# EAGLE design cp2104 (EAGLE 9.3.0)
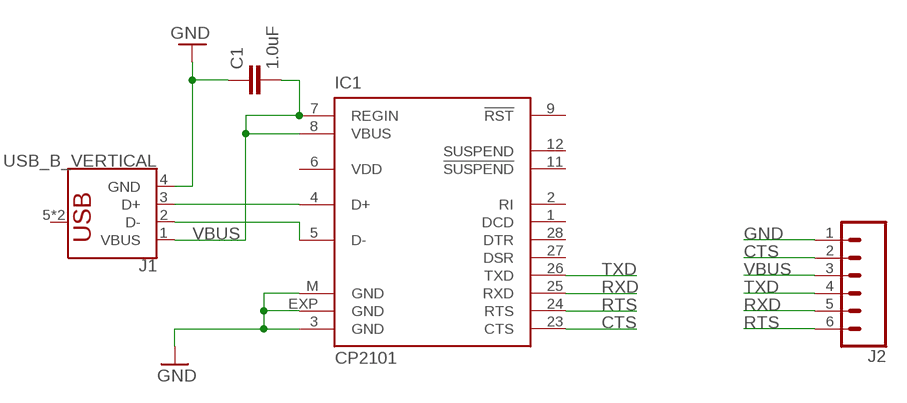
[diagram p0: schematic, sheet 1]

## Parts
C1  1.0uF  1.0UF-0805-25V-(+80/-20%)  [0805]
IC1  CP2101  CP210X_USB_UART  [MLP28]
J1  USB_B_VERTICAL  [USB_B_VERTICAL_PTH]
J2  CONN_06NO_SILK_FEMALE_PTH  [1X06_NO_SILK]

## Nets
CTS: IC1.23(CTS) J2.2
GND: C1.1 IC1.3(GND) IC1.EXP(GND) IC1.M(GND) J1.4(GND) J2.1
N$1: IC1.5(D-) J1.2(D-)
N$2: IC1.4(D+) J1.3(D+)
RTS: IC1.24(RTS) J2.6
RXD: IC1.25(RXD) J2.5
TXD: IC1.26(TXD) J2.4
VBUS: C1.2 IC1.7(REGIN) IC1.8(VBUS) J1.1(VBUS) J2.3
Unconnected: IC1.1(DCD) IC1.2(RI) IC1.9(!RST) IC1.11(!SUSPEND) IC1.12(SUSPEND) IC1.27(DSR) IC1.28(DTR) J1.5(SHIELD) J1.6(SHIELD)

## Power pins joined to a net without a drawn wire
VDD: IC1.6(VDD)

## Library data of the parts
C1 = SparkFun-Capacitors:1.0UF: 1µF ceramic capacitors A capacitor is a passive two-terminal electrical component used to store electrical energy temporarily in an electric field.; PROD_ID: CAP-11625
IC1 = SparkFun-Retired:CP210X_USB_UART: Single-Chip USB to UART Bridge Source: www.silabs.com .. CP2101.pdf / cp2102.pdf. Spark Fun Electronics SKU : COM-00310 RETIRED: IC-00865; PROD_ID: COM-00310
J1 = SparkFun-Connectors:USB_B: USB Type B Connector SparkFun Products: SparkFun Stepoko <https://www.sparkfun.com/products/13899> PTH
J2 = SparkFun-Connectors:CONN_06: Multi connection point. Often used as Generic Header-pin footprint for 0.1 inch spaced/style header connections On any of the 0.1 inch spaced packages, you can populate with these: Break Away Headers - Straight <https://www.sparkfun.com/products/116> (PRT-00116) Break Away Male Headers - Right Angle <https://www.sparkfun.com/products/553> (PRT-00553) Female Headers <https://www.sparkfun.com/products/115> (PRT-00115) Break Away Headers - Machine Pin <https://www.sparkfun.com/products/117> (PRT-00117) Break Away Female Headers - Swiss Machine Pin <https://www.sparkfun.com/products/743> (PRT-00743) Arduino Stackable Header - 6 Pin <https://www.sparkfun.com/products/9280> (PRT-09280) For SCREWTERMINALS and SPRING TERMINALS visit here: Screw Terimnals on SparkFun.com <https://www.sparkfun.com/search/results?term=Screw+Terminals> (5mm/3.5mm/2.54mm spacing) This device is also useful as a general connection point to wire up your design to another part of your project. Our various solder wires solder well into these plated through hole pads. Hook-Up Wire - Assortment (Stranded, 22 AWG) <https://www.sparkfun.com/products/11375> (PRT-11375) Hook-Up Wire - Assortment (Solid Core, 22 AWG) <https://www.sparkfun.com/products/11367> (PRT-11367) View the entire wire category on our website here <https://www.sparkfun.com/categories/141>; PROD_ID: CONN-08437

## Board
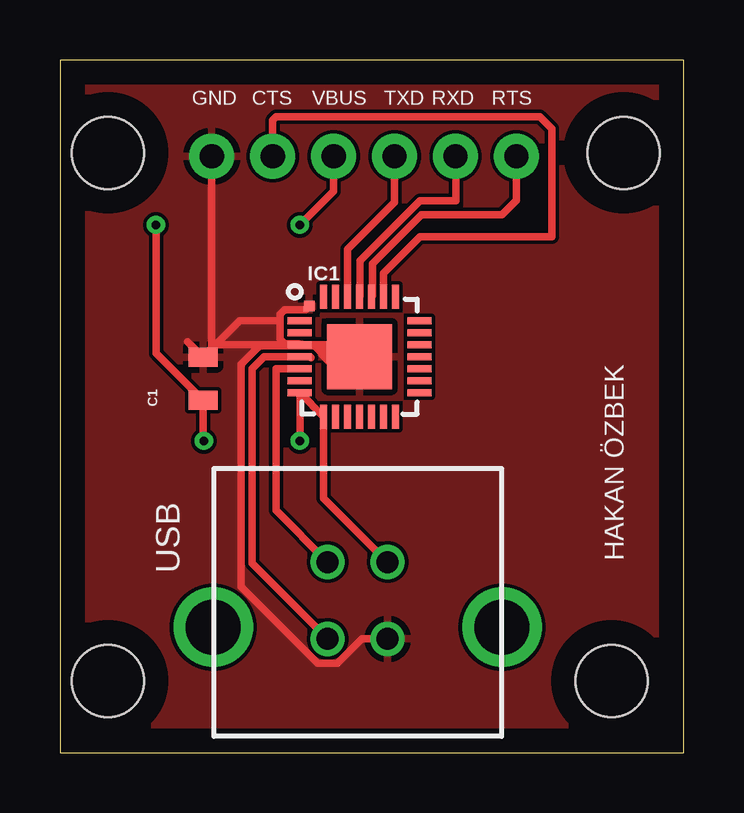
[diagram p1: board, top side]
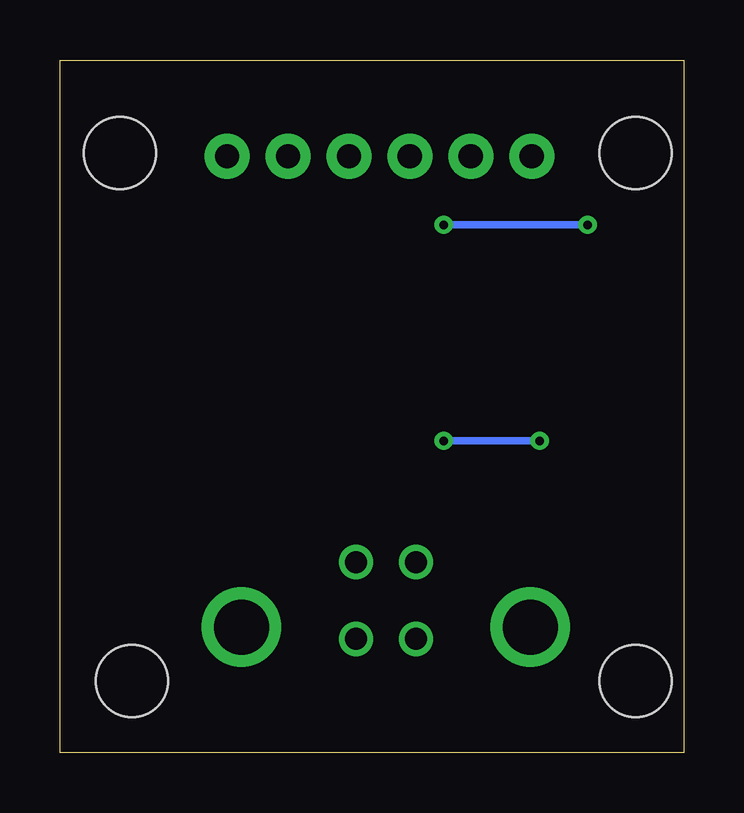
[diagram p2: board, bottom side, seen from below]

Size 26 x 28.87 mm. Coordinates in mm from the lower left corner, seen from the top.
Outline: 0,0 26,0 26,28.87 0,28.87 0,0
Copper layers (1*16): Top 0.035mm / dielectric 1.5mm / Bottom 0.035mm
Design rules "default": minimum track width 6mil, minimum drill 0.35mm, track to track 6mil, track to pad 6mil, pad to pad 6mil, via to via 6mil, smd to smd 6mil, copper to edge 40mil, drill to drill 6mil, minimum pad ring 10mil, minimum via ring 8mil, stop-mask expansion 4mil, vias tented up to drill 0mil, thermal gap 10mil
Holes 3 mm at 2,25 2,3 23.5,25 23,3

### Footprints (pad centres in the part's own frame; a part is rotated, then mirrored left to right if it is on the bottom)
0805 = smd 0.8 x 1.2: 1 -0.9,0; 2 0.9,0
MLP28 = smd 1 x 0.3: 1 -2.5,1.5; 2 -2.5,1; 3 -2.5,0.5; 4 -2.5,0; 5 -2.5,-0.5; 6 -2.5,-1; 7 -2.5,-1.5; 15 2.5,-1.5; 16 2.5,-1; 17 2.5,-0.5; 18 2.5,0; 19 2.5,0.5; 20 2.5,1; 21 2.5,1.5 | smd 0.3 x 1: 8 -1.5,-2.5; 9 -1,-2.5; 10 -0.5,-2.5; 11 0,-2.5; 12 0.5,-2.5; 13 1,-2.5; 14 1.5,-2.5; 22 1.5,2.5; 23 1,2.5; 24 0.5,2.5; 25 0,2.5; 26 -0.5,2.5; 27 -1,2.5; 28 -1.5,2.5 | smd 2.7 x 2.7: EXP 0,0 | smd 0.435 x 0.435: M -2.103,2.103
USB_B_VERTICAL_PTH = drill 0.92: 1 1.25,1.6; 2 -1.25,1.6; 3 -1.25,-1.6; 4 1.25,-1.6 | drill 2.3: 5 -6.02,-1.11; 6 6.02,-1.11
1X06_NO_SILK = drill 1.016 pad 1.88: 1 0,0; 2 2.54,0; 3 5.08,0; 4 7.62,0; 5 10.16,0; 6 12.7,0

### Placement (x,y rotation side)
C1  5.97,15.59 270 top
IC1  12.49,16.51 0 top
J1  12.41,6.35 0 top
J2  6.33,24.86 0 top

### Tracks (layer width: path | path; a pad name or v marks a point on that pad's centre or on a via)
CTS
  Top 0.305: IC1.23 13.49,19.99 15,21.5 20.5,21.5 20.5,26 20,26.5 9,26.5 8.87,26.37 J2.2
GND
  Top 0.305: C1.1 6.49,17.01 | 10.04,16.96 IC1.3 | 11.07,16.51 11.5,16.51 | 11.5,16.51 IC1.EXP 11.99,17.01 11,17.01 | 10.92,16.66 11.07,16.51 | 5.33,17.13 C1.1 | J2.1 6.33,16.85 C1.1 | 6.49,17.01 IC1.3 | 10.5,17.01 11,17.01 | 11,17.01 11.5,16.51 | IC1.3 10.5,17.01 | IC1.M 10.24,18.46 9.36,18.46 9.19,18.29 9.19,18 | 9.19,18 9.19,17.23 9.36,17.05 9.95,17.05 IC1.3 | 9.19,18 7.48,18 6.49,17.01 | 10.62,16.96 10.61,16.97 8.32,16.97 7.54,16.19 7.54,6.93 10.74,3.73 11.58,3.73 12.6,4.75 J1.4 | 11.07,16.51 11.54,16.04 12.24,15.34 13.66,15.34 13,16 11.51,16 10.92,16.59 10.92,16.66 | 10.92,16.66 10.62,16.96 | 10.62,16.96 10.54,16.96 10.5,17.01
  pour Top: 0,29 26,29 26,0 0,0
N$1
  Top 0.305: J1.2 9,10.11 9,16 IC1.5
N$2
  Top 0.305: J1.3 8,7.91 8,16 8.51,16.51 9,16.51 9.84,16.51 | 9.84,16.51 9.85,16.51 10.43,16.51 10.47,16.47 | IC1.4 9.84,16.51
RTS
  Top 0.305: IC1.24 13.04,19.05 13.04,20.39 15.07,22.43 18.43,22.43 19.03,23.03 J2.6
RXD
  Top 0.305: IC1.25 12.5,20.5 15,23 16.5,23 J2.5
TXD
  Top 0.305: IC1.26 11.99,20.99 13.95,22.95 J2.4
VBUS  (via drill 0.35)
  Top 0.305: J2.3 11.41,23.41 v10,22 | v4,22 4,16.66 C1.2 5.97,13.03 v6,13 | J1.1 10.99,10.62 IC1.8 IC1.7 | IC1.7 | IC1.7 v10,13
  Bottom 0.305: v10,22 v4,22 | v6,13 v10,13

### Text on the board
tNames: GND | CTS | VBUS | TXD | RXD | RTS | USB | HAKAN ÖZBEK